# Altium schematic sheet Ethernet1_MDIO.SchDoc
size A4; DocumentNumber: 21; SheetNumber: 21; SheetTotal: 47
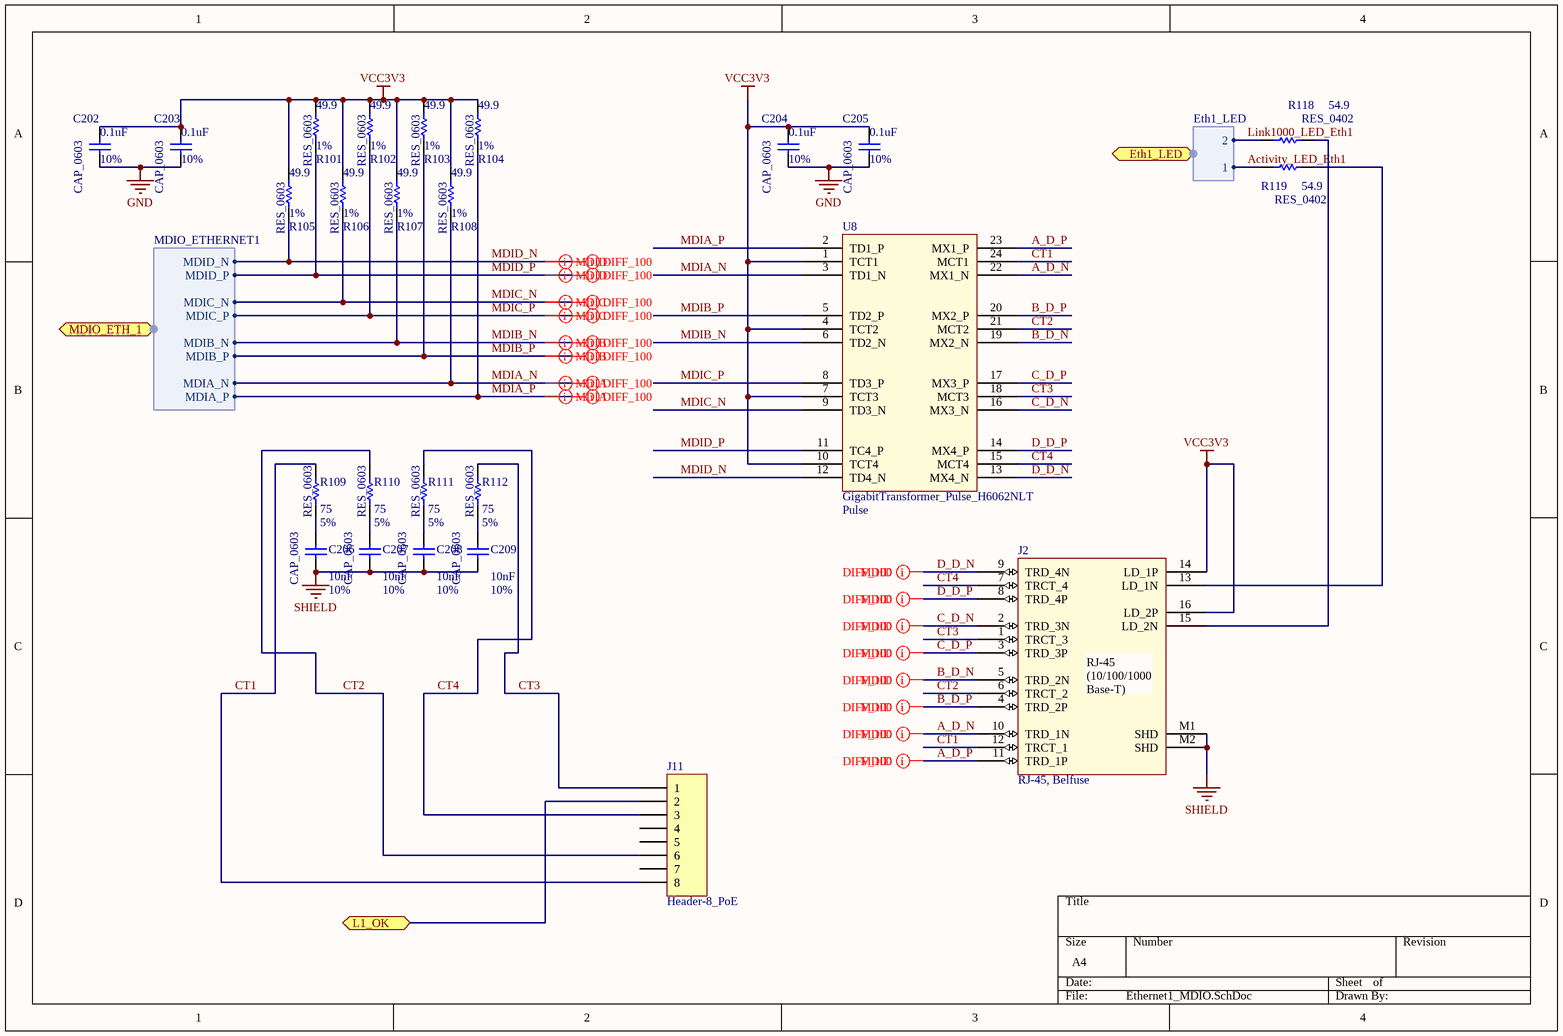
[diagram p0: Ethernet1_MDIO.SchDoc]

## Parts
C202  CAP_0603  value 0.1uF  Tolerance: 10%  [CAPC0603(1608)100_N]
C203  CAP_0603  value 0.1uF  Tolerance: 10%  [CAPC0603(1608)100_N]
C204  CAP_0603  value 0.1uF  Tolerance: 10%  [CAPC0603(1608)100_N]
C205  CAP_0603  value 0.1uF  Tolerance: 10%  [CAPC0603(1608)100_N]
C206  CAP_0603  value 10nF  Tolerance: 10%  [CAPC0603(1608)100_N]
C207  CAP_0603  value 10nF  Tolerance: 10%  [CAPC0603(1608)100_N]
C208  CAP_0603  value 10nF  Tolerance: 10%  [CAPC0603(1608)100_N]
C209  CAP_0603  value 10nF  Tolerance: 10%  [CAPC0603(1608)100_N]
J2  RJ-45, Belfuse  [RJ-45_BelFuse_L834-1G1T-S7_pcb]
J11  Header-8_PoE  [Header_FCI_20021221-00008T4LF_8-pos]
R101  RES_0603  value 49.9  Tolerance: 1%  [RESC0603(1608)_N]
R102  RES_0603  value 49.9  Tolerance: 1%  [RESC0603(1608)_N]
R103  RES_0603  value 49.9  Tolerance: 1%  [RESC0603(1608)_N]
R104  RES_0603  value 49.9  Tolerance: 1%  [RESC0603(1608)_N]
R105  RES_0603  value 49.9  Tolerance: 1%  [RESC0603(1608)_N]
R106  RES_0603  value 49.9  Tolerance: 1%  [RESC0603(1608)_N]
R107  RES_0603  value 49.9  Tolerance: 1%  [RESC0603(1608)_N]
R108  RES_0603  value 49.9  Tolerance: 1%  [RESC0603(1608)_N]
R109  RES_0603  value 75  Tolerance: 5%  [RESC0603(1608)_N]
R110  RES_0603  value 75  Tolerance: 5%  [RESC0603(1608)_N]
R111  RES_0603  value 75  Tolerance: 5%  [RESC0603(1608)_N]
R112  RES_0603  value 75  Tolerance: 5%  [RESC0603(1608)_N]
R118  RES_0402  value 54.9  [RESC0402(1005)_N]
R119  RES_0402  value 54.9  [RESC0402(1005)_N]
U8  GigabitTransformer_Pulse_H6062NLT  Manufacturer: Pulse  [GigabitTransformer_H6062NLT_SOP-24]

## Ports
Eth1_LED (harness Eth1_LED), L1_OK, MDIO_ETH_1 (harness MDIO_ETHERNET1)

## Harnesses
MDIO_ETHERNET1: MDIA_P, MDIA_N, MDIB_P, MDIB_N, MDIC_P, MDIC_N, MDID_P, MDID_N
Eth1_LED: 1, 2

## Nets
GND: C202.1 C203.1 C204.1 C205.1
SHIELD: C206.1 C207.1 C208.1 C209.1 J2.M1(SHD) J2.M2(SHD)
VCC3V3: C202.2 C203.2 C204.2 C205.2 J2.14(LD_1P) J2.16(LD_2P) R101.2 R102.2 R103.2 R104.2 R105.2 R106.2 R107.2 R108.2 U8.1(TCT1) U8.4(TCT2) U8.7(TCT3) U8.10(TCT4)
A_D_N: J2.10(TRD_1N) U8.22(MX1_N)
A_D_P: J2.11(TRD_1P) U8.23(MX1_P)
Activity_LED_Eth1: R119.2 ; port Eth1_LED.1
B_D_N: J2.5(TRD_2N) U8.19(MX2_N)
B_D_P: J2.4(TRD_2P) U8.20(MX2_P)
C_D_N: J2.2(TRD_3N) U8.16(MX3_N)
C_D_P: J2.3(TRD_3P) U8.17(MX3_P)
CT1: J2.12(TRCT_1) J11.8 R109.2 U8.24(MCT1)
CT2: J2.6(TRCT_2) J11.6 R110.2 U8.21(MCT2)
CT3: J2.1(TRCT_3) J11.1 R112.2 U8.18(MCT3)
CT4: J2.7(TRCT_4) J11.3 R111.2 U8.15(MCT4)
D_D_N: J2.9(TRD_4N) U8.13(MX4_N)
D_D_P: J2.8(TRD_4P) U8.14(MX4_P)
L1_OK: J11.2 ; port L1_OK
Link1000_LED_Eth1: R118.2 ; port Eth1_LED.2
MDIA_N: R108.1 U8.3(TD1_N) ; port MDIO_ETH_1.MDIA_N
MDIA_P: R104.1 U8.2(TD1_P) ; port MDIO_ETH_1.MDIA_P
MDIB_N: R107.1 U8.6(TD2_N) ; port MDIO_ETH_1.MDIB_N
MDIB_P: R103.1 U8.5(TD2_P) ; port MDIO_ETH_1.MDIB_P
MDIC_N: R106.1 U8.9(TD3_N) ; port MDIO_ETH_1.MDIC_N
MDIC_P: R102.1 U8.8(TD3_P) ; port MDIO_ETH_1.MDIC_P
MDID_N: R105.1 U8.12(TD4_N) ; port MDIO_ETH_1.MDID_N
MDID_P: R101.1 U8.11(TC4_P) ; port MDIO_ETH_1.MDID_P
NetC206_2: C206.2 R109.1
NetC207_2: C207.2 R110.1
NetC208_2: C208.2 R111.1
NetC209_2: C209.2 R112.1
NetJ2_13: J2.13(LD_1N) R119.1
NetJ2_15: J2.15(LD_2N) R118.1

Not connected (* = marked no-connect by the designer): J11 4 5 7

## Layout directives
differential pair: A_D_N, A_D_P, B_D_N, B_D_P, C_D_N, C_D_P, D_D_N, D_D_P, MDIA_N, MDIA_P, MDIB_N, MDIB_P, MDIC_N, MDIC_P, MDID_N, MDID_P
mark named DIFF_100: A_D_N, A_D_P, B_D_N, B_D_P, C_D_N, C_D_P, D_D_N, D_D_P, MDIA_N, MDIA_P, MDIB_N, MDIB_P, MDIC_N, MDIC_P, MDID_N, MDID_P

## Notes on the sheet
- (in symbol L834-1G1T-S7) RJ-45 / (10/100/1000 Base-T)

## Library data of the parts
C202-C205 = C0603C104K5RACTU: CAP CER 0.1UF 50V 10% X7R 0603; Manufacturer: Kemet; Part Number: C0603C104K5RACTU; Footprint Ref: CAPC0603(1608)100_N; Library Ref: CAP_0603
C206-C209 = C0603C103K5RACTU: CAP CER 10000PF 50V 10% X7R 0603; Manufacturer: Kemet; Part Number: C0603C103K5RACTU; Footprint Ref: CAPC0603(1608)100_N; Library Ref: CAP_0603
J2 = L834-1G1T-S7: RJ-45, Belfuse, Gigabit Magnetic Jack; Part Number: L834-1G1T-S7; Manufacturer: Belfuse
J11 = 20021221-00008T4LF: CONN HEADER 8POS DUAL SHRD SMD; Manufacturer: FCI; Part Number: 20021221-00008T4LF
R101-R108 = ERJ-3EKF49R9V: RES 49.9 OHM 1/10W 1% 0603 SMD; Manufacturer: Panasonic Electronics Components; Part Number: ERJ-3EKF49R9V; Footprint Ref: RESC0603(1608)_N; Library Ref: RES_0603
R109-R112 = ERJ-3GEYJ750V: RES 75 OHM 1/10W 5% 0603 SMD; Manufacturer: Panasonic Electronic Components; Part Number: ERJ-3GEYJ750V; Footprint Ref: RESC0603(1608)_N; Library Ref: RES_0603
R118 R119 = ERJ-2RKF54R9X: RES 54.9 OHM 1/10W 1% 0402 SMD; Manufacturer: Panasonic Electronic Components; Tolerance: *; Part Number: ERJ-2RKF54R9X; Footprint Ref: RESC0402(1005)_N; Library Ref: RES_0402
U8 = H6062NLT: Magnetics, GigabitTransformer, H6062NLT, Pulse; Part Number: H6062NLT; Footprint Ref: GigabitTransformer_H6062NLT_SOP-24; Library Ref: GigabitTransformer_H6062NLT